# Altium schematic sheet STM32F407ZGT6.SchDoc
size C
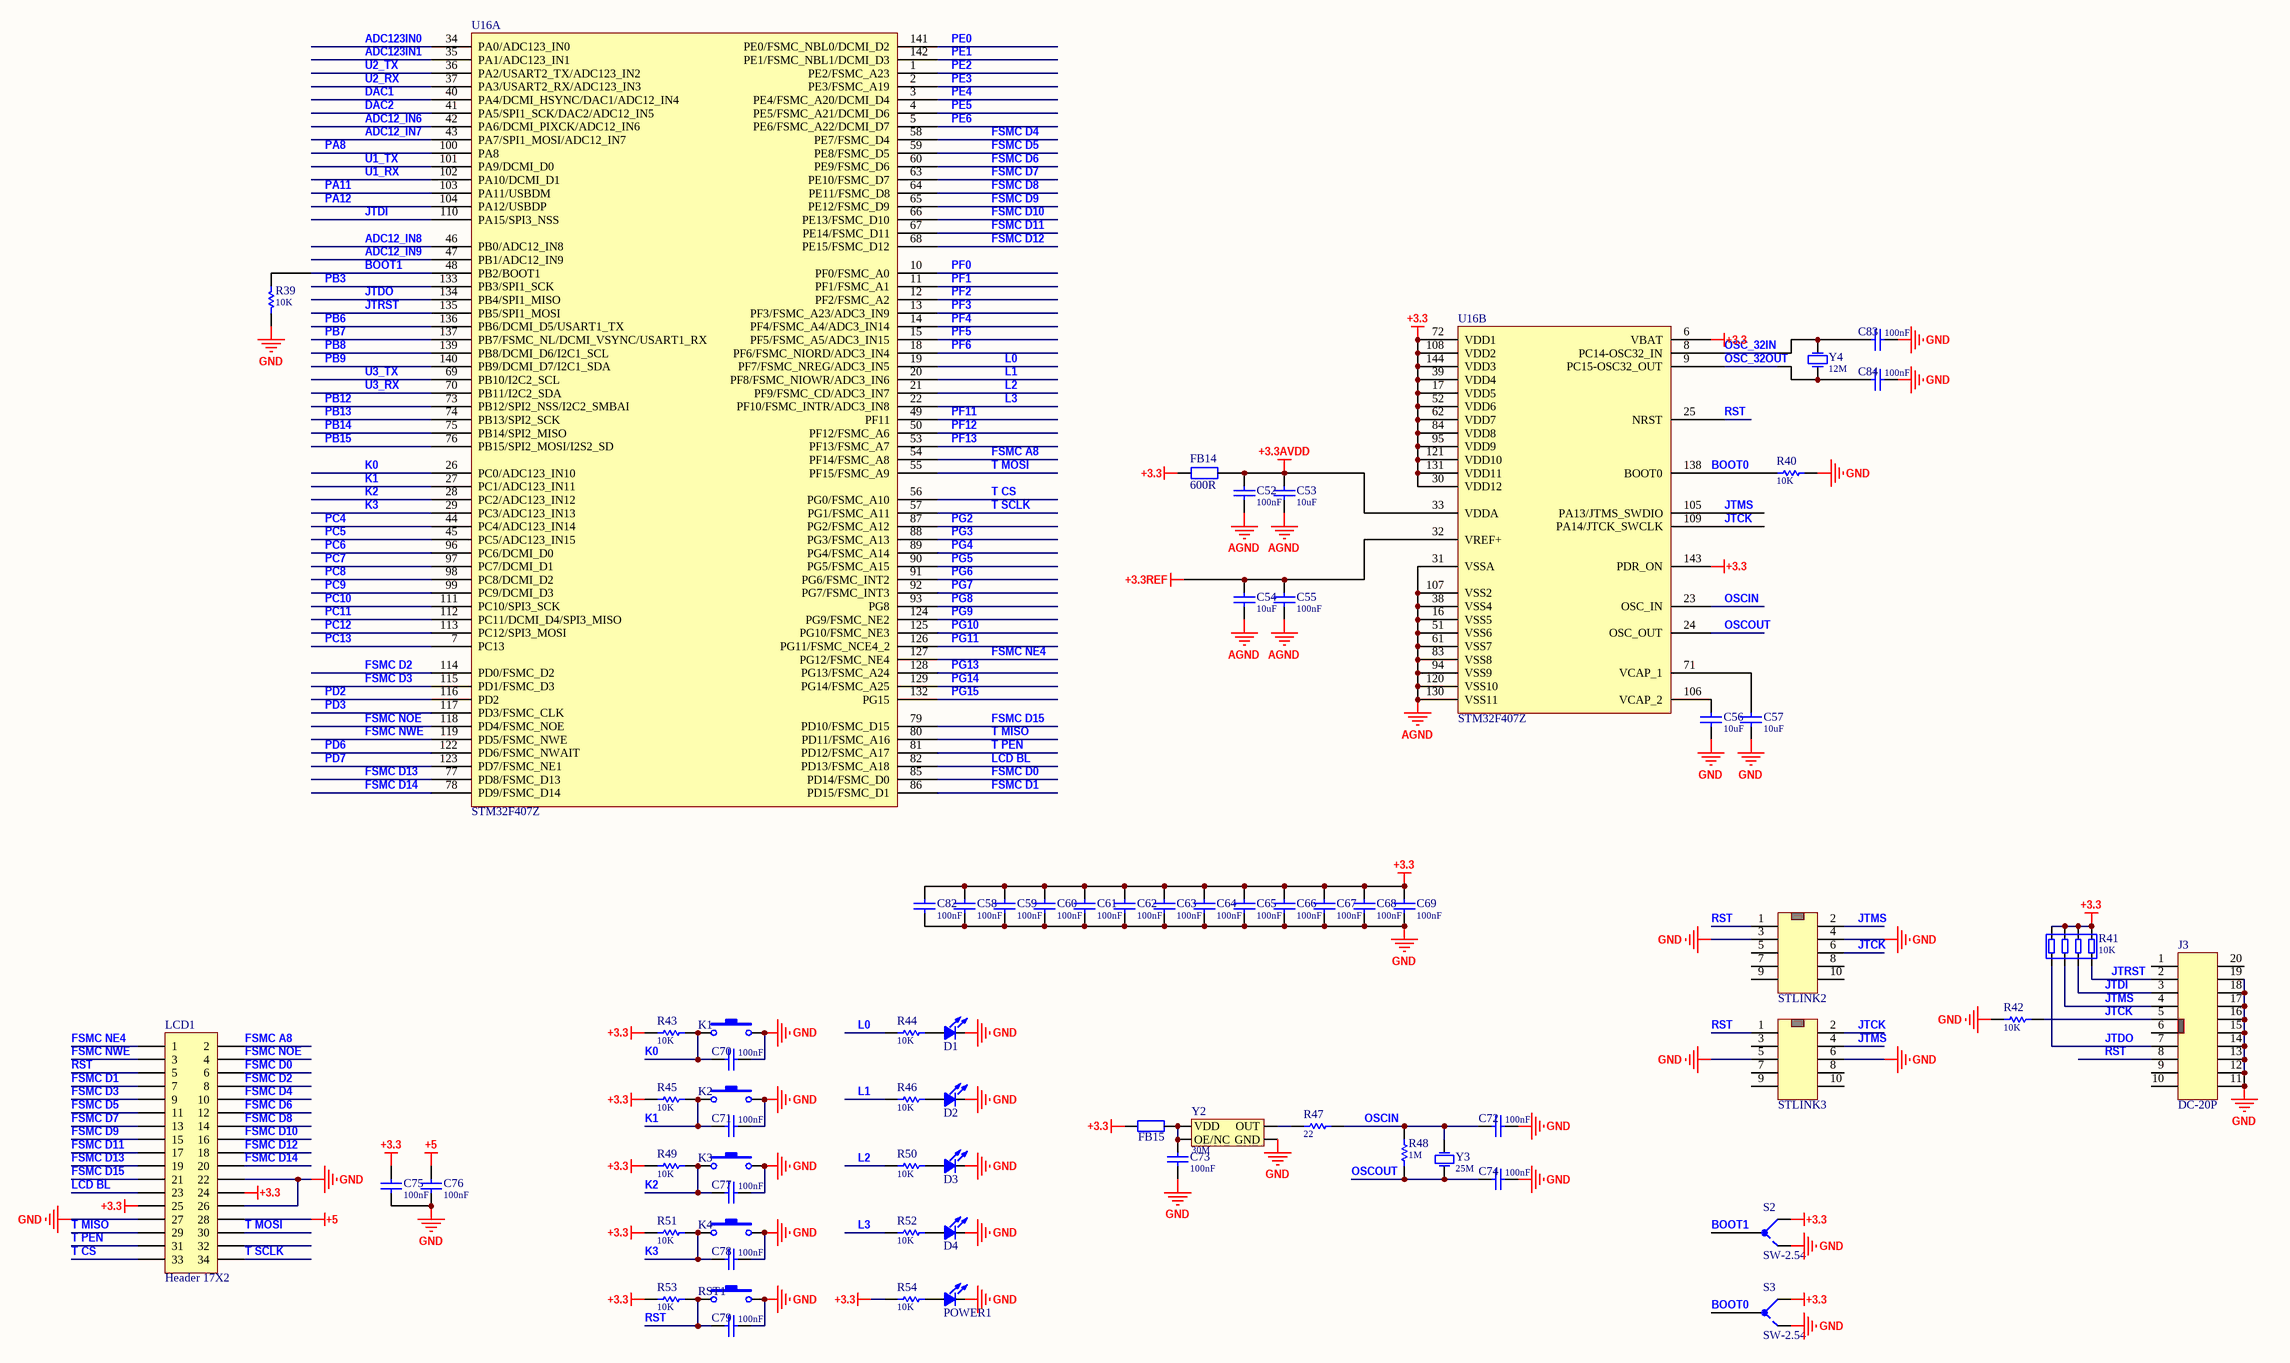
[diagram p0: STM32F407ZGT6.SchDoc]

## Parts
C52  value 100nF  [C0603-L]  (hidden comment: Cap-S)
C53  value 10uF  [C0603-L]  (hidden comment: Cap-S)
C54  value 10uF  [C0603-L]  (hidden comment: Cap-S)
C55  value 100nF  [C0603-L]  (hidden comment: Cap-S)
C56  value 10uF  [C0603-L]  (hidden comment: Cap-S)
C57  value 10uF  [C0603-L]  (hidden comment: Cap-S)
C58  value 100nF  [C0603-L]  (hidden comment: Cap-S)
C59  value 100nF  [C0603-L]  (hidden comment: Cap-S)
C60  value 100nF  [C0603-L]  (hidden comment: Cap-S)
C61  value 100nF  [C0603-L]  (hidden comment: Cap-S)
C62  value 100nF  [C0603-L]  (hidden comment: Cap-S)
C63  value 100nF  [C0603-L]  (hidden comment: Cap-S)
C64  value 100nF  [C0603-L]  (hidden comment: Cap-S)
C65  value 100nF  [C0603-L]  (hidden comment: Cap-S)
C66  value 100nF  [C0603-L]  (hidden comment: Cap-S)
C67  value 100nF  [C0603-L]  (hidden comment: Cap-S)
C68  value 100nF  [C0603-L]  (hidden comment: Cap-S)
C69  value 100nF  [C0603-L]  (hidden comment: Cap-S)
C70  value 100nF  [C0603-L]  (hidden comment: Cap-S)
C71  value 100nF  [C0603-L]  (hidden comment: Cap-S)
C72  value 100nF  [C0603-L]  (hidden comment: Cap-S)
C73  value 100nF  [C0603-L]  (hidden comment: Cap-S)
C74  value 100nF  [C0603-L]  (hidden comment: Cap-S)
C75  value 100nF  [C0603-L]  (hidden comment: Cap-S)
C76  value 100nF  [C0603-L]  (hidden comment: Cap-S)
C77  value 100nF  [C0603-L]  (hidden comment: Cap-S)
C78  value 100nF  [C0603-L]  (hidden comment: Cap-S)
C79  value 100nF  [C0603-L]  (hidden comment: Cap-S)
C82  value 100nF  [C0603-L]  (hidden comment: Cap-S)
C83  value 100nF  [C0603-L]  (hidden comment: Cap-S)
C84  value 100nF  [C0603-L]  (hidden comment: Cap-S)
D1  LED  [Led-0805_M]  (value not drawn)
D2  LED  [Led-0805_M]  (value not drawn)
D3  LED  [Led-0805_M]  (value not drawn)
D4  LED  [Led-0805_M]  (value not drawn)
FB14  600R  [FB-0603]
FB15  FB  [FB0805]  (value not drawn)
J3  DC-20P  [DC-20P]
K1  SW-PB2  [SW-PB2-SMD]  (value not drawn)
K2  SW-PB2  [SW-PB2-SMD]  (value not drawn)
K3  SW-PB2  [SW-PB2-SMD]  (value not drawn)
K4  SW-PB2  [SW-PB2-SMD]  (value not drawn)
LCD1  Header 17X2  [HDR2X17]
POWER1  LED  [Led-0805_M]  (value not drawn)
R39  value 10K  [R0603-L]  (hidden comment: R)
R40  value 10K  [R0603-L]  (hidden comment: R)
R41  value 10K  [R0603X4]  (hidden comment: R)
R42  value 10K  [R0603-L]  (hidden comment: R)
R43  value 10K  [R0603-L]  (hidden comment: R)
R44  value 10K  [R0603-L]  (hidden comment: R)
R45  value 10K  [R0603-L]  (hidden comment: R)
R46  value 10K  [R0603-L]  (hidden comment: R)
R47  value 22  [R0603-L]  (hidden comment: R)
R48  value 1M  [R0603-L]  (hidden comment: R)
R49  value 10K  [R0603-L]  (hidden comment: R)
R50  value 10K  [R0603-L]  (hidden comment: R)
R51  value 10K  [R0603-L]  (hidden comment: R)
R52  value 10K  [R0603-L]  (hidden comment: R)
R53  value 10K  [R0603-L]  (hidden comment: R)
R54  value 10K  [R0603-L]  (hidden comment: R)
RST1  SW-PB2  [SW-PB2-SMD]  (value not drawn)
S2  SW-2.54  [SW-2.54-3PDIP]
S3  SW-2.54  [SW-2.54-3PDIP]
STLINK2  JTAG  [JTAG-2.56_10]  (value not drawn)
STLINK3  JTAG  [JTAG-2.56_10]  (value not drawn)
U16  STM32F407Z  [TQFP-144]  (parts A,B of 2)
Y2  value 30M  [XTAL-7050_M]  (hidden comment: XTALS)
Y3  value 25M  [XTAL-PB2-SMD]  (hidden comment: XTAL)
Y4  value 12M  [XTAL-32768]  (hidden comment: XTAL)

## Nets
+3.3: C58.2 C59.2 C60.2 C61.2 C62.2 C63.2 C64.2 C65.2 C66.2 C67.2 C68.2 C69.2 C75.2 C82.2 FB14.2 FB15.1 LCD1.24 LCD1.25 R41.5 R41.6 R41.7 R41.8 R43.1 R45.1 R49.1 R51.1 R53.1 R54.1 S2.1 S3.1 U16.6(VBAT) U16.17(VDD5) U16.30(VDD12) U16.39(VDD4) U16.52(VDD6) U16.62(VDD7) U16.72(VDD1) U16.84(VDD8) U16.95(VDD9) U16.108(VDD2) U16.121(VDD10) U16.131(VDD11) U16.143(PDR_ON) U16.144(VDD3)
+3.3AVDD: C52.2 C53.2 FB14.1 U16.33(VDDA)
+3.3REF: C54.2 C55.2 U16.32(VREF+)
+5: C76.2 LCD1.28
AGND: C52.1 C53.1 C54.1 C55.1 U16.16(VSS5) U16.31(VSSA) U16.38(VSS4) U16.51(VSS6) U16.61(VSS7) U16.83(VSS8) U16.94(VSS9) U16.107(VSS2) U16.120(VSS10) U16.130(VSS11)
GND: C56.1 C57.1 C58.1 C59.1 C60.1 C61.1 C62.1 C63.1 C64.1 C65.1 C66.1 C67.1 C68.1 C69.1 C70.1 C71.1 C72.1 C73.2 C74.1 C75.1 C76.1 C77.1 C78.1 C79.1 C82.1 C83.1 C84.1 D1.2 D2.2 D3.2 D4.2 J3.11 J3.12 J3.13 J3.14 J3.15 J3.16 J3.17 J3.18 J3.19 K1.2 K2.2 K3.2 K4.2 LCD1.22 LCD1.26 LCD1.27 POWER1.2 R39.1 R40.1 R42.2 RST1.2 S2.3 S3.3 STLINK2.3 STLINK2.4 STLINK3.5 STLINK3.6 Y2.2(GND)
ADC12_IN6: U16.42(PA6/DCMI_PIXCK/ADC12_IN6)
ADC12_IN7: U16.43(PA7/SPI1_MOSI/ADC12_IN7)
ADC12_IN8: U16.46(PB0/ADC12_IN8)
ADC12_IN9: U16.47(PB1/ADC12_IN9)
ADC123IN0: U16.34(PA0/ADC123_IN0)
ADC123IN1: U16.35(PA1/ADC123_IN1)
BOOT0: R40.2 S3.2 U16.138(BOOT0)
BOOT1: R39.2 S2.2 U16.48(PB2/BOOT1)
DAC1: U16.40(PA4/DCMI_HSYNC/DAC1/ADC12_IN4)
DAC2: U16.41(PA5/SPI1_SCK/DAC2/ADC12_IN5)
FSMC A8: LCD1.2 U16.54(PF14/FSMC_A8)
FSMC D0: LCD1.6 U16.85(PD14/FSMC_D0)
FSMC D1: LCD1.7 U16.86(PD15/FSMC_D1)
FSMC D2: LCD1.8 U16.114(PD0/FSMC_D2)
FSMC D3: LCD1.9 U16.115(PD1/FSMC_D3)
FSMC D4: LCD1.10 U16.58(PE7/FSMC_D4)
FSMC D5: LCD1.11 U16.59(PE8/FSMC_D5)
FSMC D6: LCD1.12 U16.60(PE9/FSMC_D6)
FSMC D7: LCD1.13 U16.63(PE10/FSMC_D7)
FSMC D8: LCD1.14 U16.64(PE11/FSMC_D8)
FSMC D9: LCD1.15 U16.65(PE12/FSMC_D9)
FSMC D10: LCD1.16 U16.66(PE13/FSMC_D10)
FSMC D11: LCD1.17 U16.67(PE14/FSMC_D11)
FSMC D12: LCD1.18 U16.68(PE15/FSMC_D12)
FSMC D13: LCD1.19 U16.77(PD8/FSMC_D13)
FSMC D14: LCD1.20 U16.78(PD9/FSMC_D14)
FSMC D15: LCD1.21 U16.79(PD10/FSMC_D15)
FSMC NE4: LCD1.1 U16.127(PG12/FSMC_NE4)
FSMC NOE: LCD1.4 U16.118(PD4/FSMC_NOE)
FSMC NWE: LCD1.3 U16.119(PD5/FSMC_NWE)
JTCK: J3.5 R42.1 STLINK2.6 STLINK3.2 U16.109(PA14/JTCK_SWCLK)
JTDI: J3.3 R41.3 U16.110(PA15/SPI3_NSS)
JTDO: J3.7 R41.1 U16.134(PB4/SPI1_MISO)
JTMS: J3.4 R41.2 STLINK2.2 STLINK3.4 U16.105(PA13/JTMS_SWDIO)
JTRST: J3.2 R41.4 U16.135(PB5/SPI1_MOSI)
K0: C70.2 K1.1 R43.2 U16.26(PC0/ADC123_IN10)
K1: C71.2 K2.1 R45.2 U16.27(PC1/ADC123_IN11)
K2: C77.2 K3.1 R49.2 U16.28(PC2/ADC123_IN12)
K3: C78.2 K4.1 R51.2 U16.29(PC3/ADC123_IN13)
L0: R44.1 U16.19(PF7/FSMC_NREG/ADC3_IN5)
L1: R46.1 U16.20(PF8/FSMC_NIOWR/ADC3_IN6)
L2: R50.1 U16.21(PF9/FSMC_CD/ADC3_IN7)
L3: R52.1 U16.22(PF10/FSMC_INTR/ADC3_IN8)
LCD BL: LCD1.23 U16.82(PD13/FSMC_A18)
OSC_32IN: C83.2 U16.8(PC14-OSC32_IN) Y4.2(OSC2)
OSC_32OUT: C84.2 U16.9(PC15-OSC32_OUT) Y4.1(OSC1)
OSCIN: C72.2 R47.1 R48.2 U16.23(OSC_IN) Y3.2(OSC2)
OSCOUT: C74.2 R48.1 U16.24(OSC_OUT) Y3.1(OSC1)
PA8: U16.100(PA8)
PA11: U16.103(PA11/USBDM)
PA12: U16.104(PA12/USBDP)
PB3: U16.133(PB3/SPI1_SCK)
PB6: U16.136(PB6/DCMI_D5/USART1_TX)
PB7: U16.137(PB7/FSMC_NL/DCMI_VSYNC/USART1_RX)
PB8: U16.139(PB8/DCMI_D6/I2C1_SCL)
PB9: U16.140(PB9/DCMI_D7/I2C1_SDA)
PB12: U16.73(PB12/SPI2_NSS/I2C2_SMBAI)
PB13: U16.74(PB13/SPI2_SCK)
PB14: U16.75(PB14/SPI2_MISO)
PB15: U16.76(PB15/SPI2_MOSI/I2S2_SD)
PC4: U16.44(PC4/ADC123_IN14)
PC5: U16.45(PC5/ADC123_IN15)
PC6: U16.96(PC6/DCMI_D0)
PC7: U16.97(PC7/DCMI_D1)
PC8: U16.98(PC8/DCMI_D2)
PC9: U16.99(PC9/DCMI_D3)
PC10: U16.111(PC10/SPI3_SCK)
PC11: U16.112(PC11/DCMI_D4/SPI3_MISO)
PC12: U16.113(PC12/SPI3_MOSI)
PC13: U16.7(PC13)
PD2: U16.116(PD2)
PD3: U16.117(PD3/FSMC_CLK)
PD6: U16.122(PD6/FSMC_NWAIT)
PD7: U16.123(PD7/FSMC_NE1)
PE0: U16.141(PE0/FSMC_NBL0/DCMI_D2)
PE1: U16.142(PE1/FSMC_NBL1/DCMI_D3)
PE2: U16.1(PE2/FSMC_A23)
PE3: U16.2(PE3/FSMC_A19)
PE4: U16.3(PE4/FSMC_A20/DCMI_D4)
PE5: U16.4(PE5/FSMC_A21/DCMI_D6)
PE6: U16.5(PE6/FSMC_A22/DCMI_D7)
PF0: U16.10(PF0/FSMC_A0)
PF1: U16.11(PF1/FSMC_A1)
PF2: U16.12(PF2/FSMC_A2)
PF3: U16.13(PF3/FSMC_A23/ADC3_IN9)
PF4: U16.14(PF4/FSMC_A4/ADC3_IN14)
PF5: U16.15(PF5/FSMC_A5/ADC3_IN15)
PF6: U16.18(PF6/FSMC_NIORD/ADC3_IN4)
PF11: U16.49(PF11)
PF12: U16.50(PF12/FSMC_A6)
PF13: U16.53(PF13/FSMC_A7)
PG2: U16.87(PG2/FSMC_A12)
PG3: U16.88(PG3/FSMC_A13)
PG4: U16.89(PG4/FSMC_A14)
PG5: U16.90(PG5/FSMC_A15)
PG6: U16.91(PG6/FSMC_INT2)
PG7: U16.92(PG7/FSMC_INT3)
PG8: U16.93(PG8)
PG9: U16.124(PG9/FSMC_NE2)
PG10: U16.125(PG10/FSMC_NE3)
PG11: U16.126(PG11/FSMC_NCE4_2)
PG13: U16.128(PG13/FSMC_A24)
PG14: U16.129(PG14/FSMC_A25)
PG15: U16.132(PG15)
RST: C79.2 J3.8 LCD1.5 R53.2 RST1.1 STLINK2.1 STLINK3.1 U16.25(NRST)
T CS: LCD1.33 U16.56(PG0/FSMC_A10)
T MISO: LCD1.29 U16.80(PD11/FSMC_A16)
T MOSI: LCD1.30 U16.55(PF15/FSMC_A9)
T PEN: LCD1.31 U16.81(PD12/FSMC_A17)
T SCLK: LCD1.34 U16.57(PG1/FSMC_A11)
U1_RX: U16.102(PA10/DCMI_D1)
U1_TX: U16.101(PA9/DCMI_D0)
U2_RX: U16.37(PA3/USART2_RX/ADC123_IN3)
U2_TX: U16.36(PA2/USART2_TX/ADC123_IN2)
U3_RX: U16.70(PB11/I2C2_SDA)
U3_TX: U16.69(PB10/I2C2_SCL)
NetC56_2: C56.2 U16.106(VCAP_2)
NetC57_2: C57.2 U16.71(VCAP_1)
NetC73_1: C73.1 FB15.2 Y2.1(OE/NC) Y2.4(VDD)
NetD1_1: D1.1 R44.2
NetD2_1: D2.1 R46.2
NetD3_1: D3.1 R50.2
NetD4_1: D4.1 R52.2
NetPOWER1_1: POWER1.1 R54.2
NetR47_2: R47.2 Y2.3(OUT)

Not connected (* = marked no-connect by the designer): J3 1 6 9 10 20; LCD1 32; STLINK2 5 7 8 9 10; STLINK3 3 7 8 9 10

## Library data of the parts
C52-C79 C82-C84 = Cap-S: 贴片瓷片电容
D1-D4 POWER1 = LED: 发光二极管
FB14 = FB
FB15 = FB: 磁珠
K1-K4 RST1 = SW-PB2: 贴片式2脚微动开关
LCD1 = Header 17X2: Header, 17-Pin, Dual row; LatestRevisionDate: 17-Jul-2002; LatestRevisionNote: Re-released for DXP Platform.; Publisher: Altium Limited
R39 R40 R42-R54 = Res: 贴片电阻
R41 = Res-4R: 排阻 4
S2 S3 = SW-2.54-3P
STLINK2 STLINK3 = JTAG-2.56_2X5
U16 = STM32F407Z: STM32单片机144引脚
Y2 = XTALS: 贴片有源晶振
Y3 Y4 = XTAL: 晶振